# EAGLE design BalloonBoard (EAGLE 6.3)
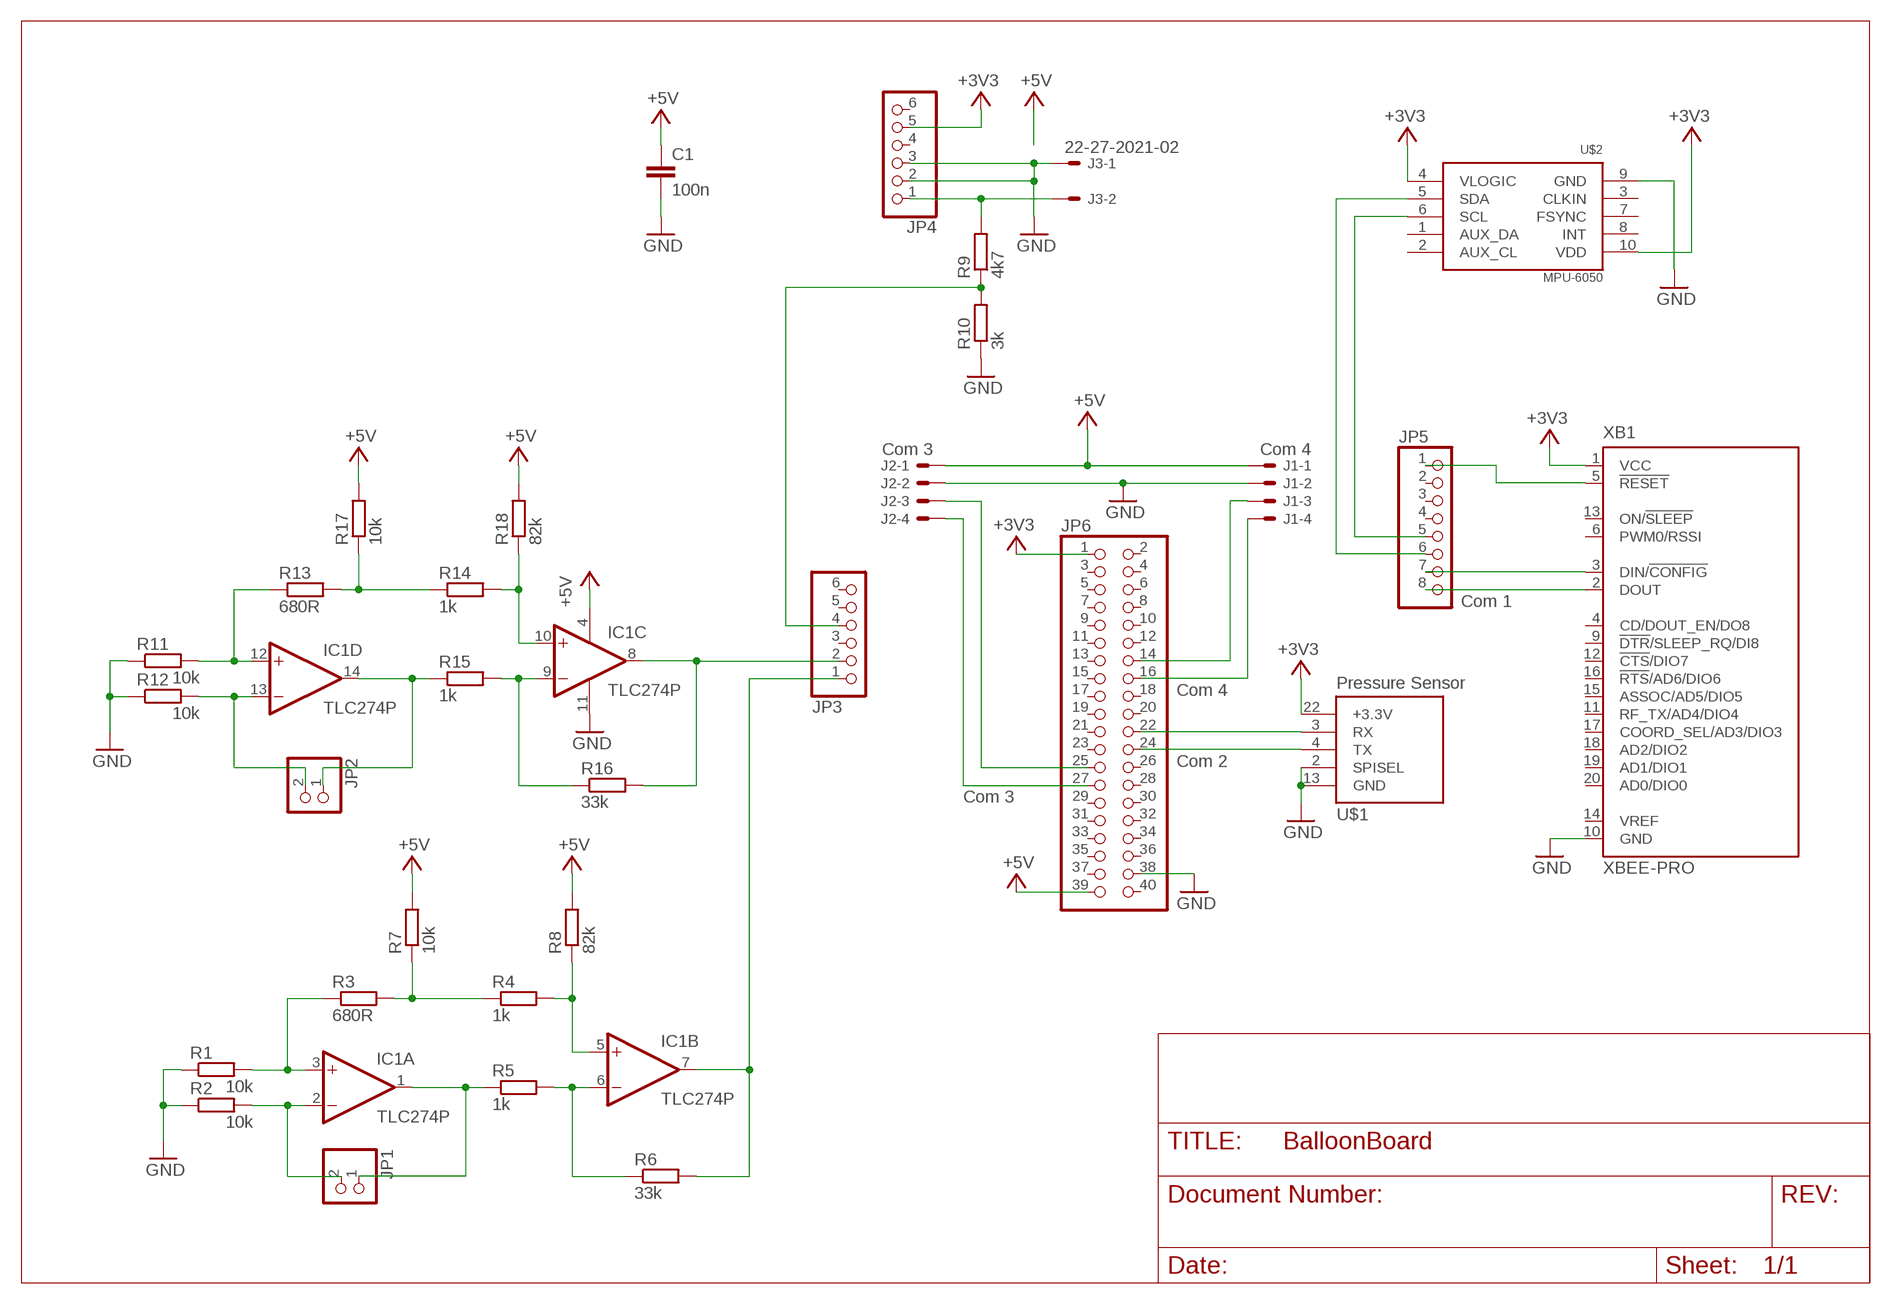
[diagram p0: schematic, sheet 1]

## Parts
C1  100n  C2.5/2  [C2.5-2]
IC1  TLC274P  [DIL14]
J1  Com 4  22-27-2041-04  [6410-04]
J2  Com 3  22-27-2041-04  [6410-04]
J3  22-27-2021-02  [6410-02]
JP1  PINHD-1X2  [1X02]
JP2  PINHD-1X2  [1X02]
JP3  PINHD-1X6  [1X06]
JP4  PINHD-1X6  [1X06]
JP5  PINHD-1X8  [1X08]
JP6  PINHD-2X20  [2X20]
R1  10k  R-EU_0207/10  [0207/10]
R2  10k  R-EU_0207/10  [0207/10]
R3  680R  R-EU_0207/10  [0207/10]
R4  1k  R-EU_0207/10  [0207/10]
R5  1k  R-EU_0207/10  [0207/10]
R6  33k  R-EU_0207/10  [0207/10]
R7  10k  R-EU_0207/10  [0207/10]
R8  82k  R-EU_0207/10  [0207/10]
R9  4k7  R-EU_0207/10  [0207/10]
R10  3k  R-EU_0207/10  [0207/10]
R11  10k  R-EU_0207/10  [0207/10]
R12  10k  R-EU_0207/10  [0207/10]
R13  680R  R-EU_0207/10  [0207/10]
R14  1k  R-EU_0207/10  [0207/10]
R15  1k  R-EU_0207/12  [0207/12]
R16  33k  R-EU_0207/10  [0207/10]
R17  10k  R-EU_0207/10  [0207/10]
R18  82k  R-EU_0207/10  [0207/10]
U$1  PRESSUREMODULE  [DIL24]
U$2  MPU-6050  [MPU-6050_BREAKOUT]
XB1  XBEE-PRO  [XBEE-PRO]

## Nets
+3V3: JP6.1 U$1.22(+3.3V) XB1.1(VCC)
+3V3_B: JP4.5 U$2.4(VLOGIC) U$2.10(VDD) ; supply symbol labelled +3V3
+5V: C1.1 IC1.4(P:V+) J1.1 J2.1 JP6.39 R7.2 R8.2 R17.2 R18.2
GND: C1.2 IC1.11(P:V-) J1.2 J2.2 J3.1 JP4.2 JP4.3 JP6.38 R1.1 R2.1 R10.1 R11.1 R12.1 U$1.2(SPISEL) U$1.13(GND) U$2.9(GND) XB1.10(GND)
N$1: IC1.2(A:-IN) JP1.2 R2.2
N$2: IC1.3(A:+IN) R1.2 R3.1
N$3: R3.2 R4.1 R7.1
N$4: IC1.5(B:+IN) R4.2 R8.1
N$5: IC1.6(B:-IN) R5.2 R6.1
N$6: IC1.1(A:OUT) JP1.1 R5.1
N$7: IC1.13(D:-IN) JP2.2 R12.2
N$8: J3.2 JP4.1 R9.2
N$9: IC1.7(B:OUT) JP3.1 R6.2
N$10: IC1.12(D:+IN) R11.2 R13.1
N$11: R13.2 R14.1 R17.1
N$12: IC1.10(C:+IN) R14.2 R18.1
N$13: IC1.9(C:-IN) R15.2 R16.1
N$14: IC1.14(D:OUT) JP2.1 R15.1
N$15: JP5.1 XB1.5(!RESET)
N$16: IC1.8(C:OUT) JP3.2 R16.2
N$17: JP5.8 XB1.2(DOUT)
N$18: JP5.7 XB1.3(DIN/!CONFIG)
N$19: JP3.4 R9.1 R10.2
N$20: JP5.6 U$2.5(SDA)
N$21: J1.3 JP6.14
N$22: J1.4 JP6.16
N$23: J2.3 JP6.25
N$24: J2.4 JP6.27
N$25: JP5.5 U$2.6(SCL)
N$26: JP6.22 U$1.3(RX)
N$27: JP6.24 U$1.4(TX)
Unconnected: JP3.3 JP3.5 JP3.6 JP4.4 JP4.6 JP5.2 JP5.3 JP5.4 JP6.2 JP6.3 JP6.4 JP6.5 JP6.6 JP6.7 JP6.8 JP6.9 JP6.10 JP6.11 JP6.12 JP6.13 JP6.15 JP6.17 JP6.18 JP6.19 JP6.20 JP6.21 JP6.23 JP6.26 JP6.28 JP6.29 JP6.30 JP6.31 JP6.32 JP6.33 JP6.34 JP6.35 JP6.36 JP6.37 JP6.40 U$2.1(AUX_DA) U$2.2(AUX_CL) U$2.3(CLKIN) U$2.7(FSYNC) U$2.8(INT) XB1.4(CD/DOUT_EN/DO8) XB1.6(PWM0/RSSI) XB1.9(!DTR!/SLEEP_RQ/DI8) XB1.11(RF_TX/AD4/DIO4) XB1.12(!CTS!/DIO7) XB1.13(ON/!SLEEP) XB1.14(VREF) XB1.15(ASSOC/AD5/DIO5) XB1.16(!RTS!/AD6/DIO6) XB1.17(COORD_SEL/AD3/DIO3) XB1.18(AD2/DIO2) XB1.19(AD1/DIO1) XB1.20(AD0/DIO0)

## Notes on the sheet
- Com 1
- Com 4
- Com 2
- Com 3

## Library data of the parts
C1 = capacitor-wima:C: CAPACITOR naming: grid - package width
IC1 = linear:TLC274: OP AMP
J1 J2 = con-molex:22-?-04: CONNECTOR wire to board 2.54 mm (.1 inch) pitch header; OC_FARNELL: unknown; OC_NEWARK: unknown
J3 = con-molex:22-?-02: CONNECTOR wire to board 2.54 mm (.1 inch) pitch header; OC_FARNELL: unknown; OC_NEWARK: unknown
JP1 JP2 = pinhead:PINHD-1X2: PIN HEADER
JP3 JP4 = pinhead:PINHD-1X6: PIN HEADER
JP5 = pinhead:PINHD-1X8: PIN HEADER
JP6 = pinhead:PINHD-2X20: PIN HEADER
R1-R18 = resistor:R-EU_: RESISTOR, European symbol
U$1 = SpaceBallonV3:PRESSUREMODULE
U$2 = SpaceBallonV3:MPU-6050
XB1 = maxstream:XBEE: XBee (TM) /XBee-PRO(TM) OEM RF Modules Source: MaxStream, Inc. xbee_productmanual.pdf; MPN: XBP24-AWI-001; OC_FARNELL: 1337916; OC_NEWARK: 42M2667

## Board
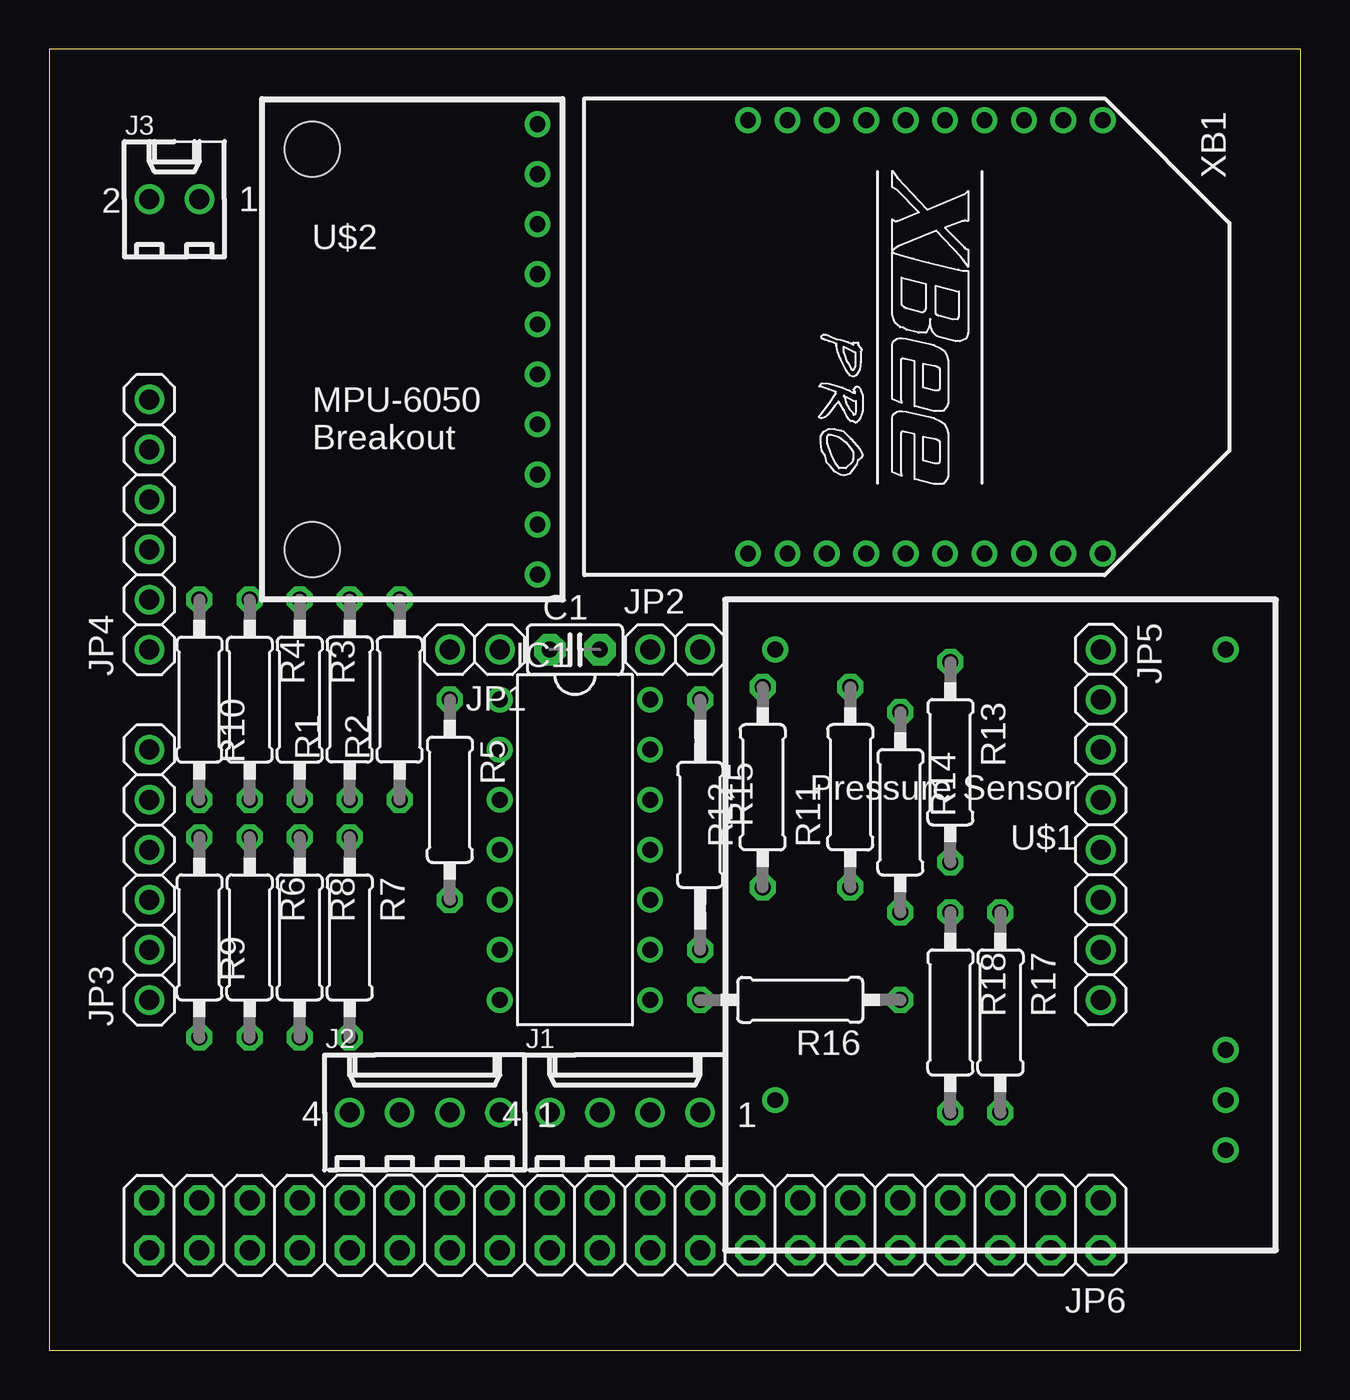
[diagram p1: board, top side]
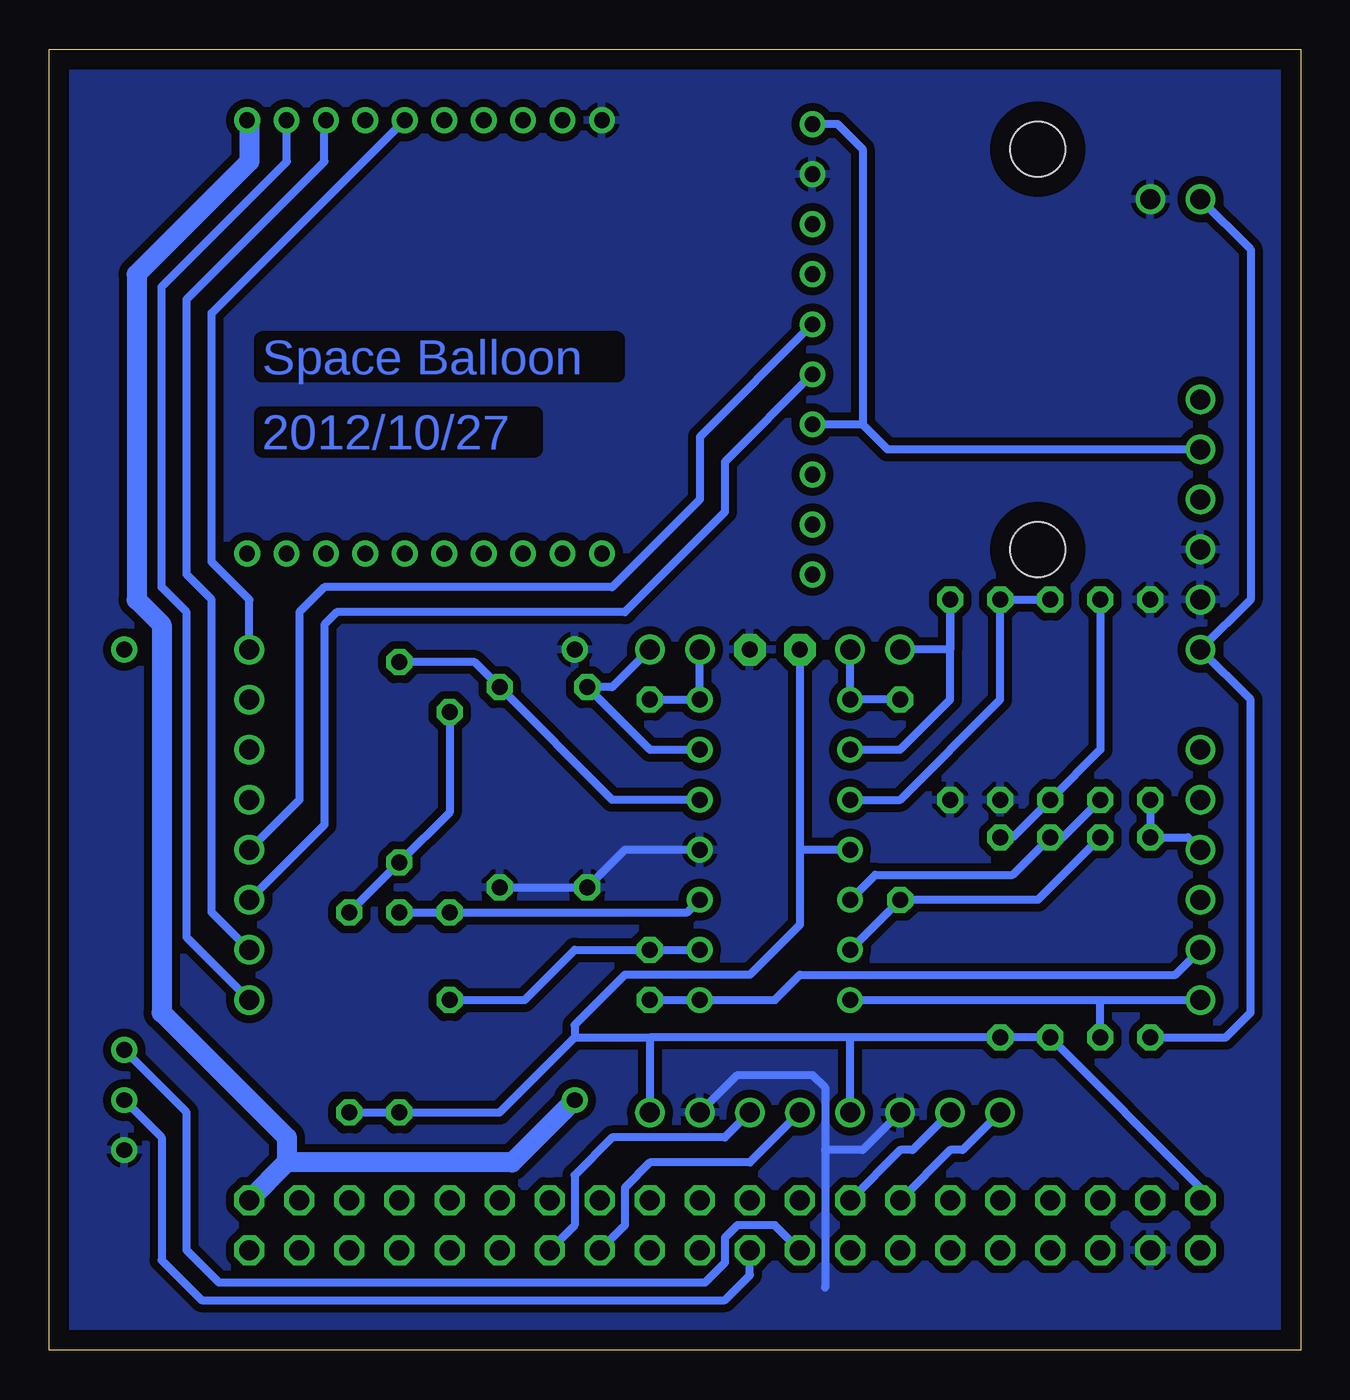
[diagram p2: board, bottom side, seen from below]

Size 63.49 x 66.03 mm. Coordinates in mm from the lower left corner, seen from the top.
Outline: 0,0 63.49,0 63.49,66.03 0,66.03 0,0
Copper layers (1*16): Top 0.035mm / dielectric 1.5mm / Bottom 0.035mm
Design rules "default": minimum track width 10mil, minimum drill 24mil, track to track 8mil, track to pad 8mil, pad to pad 8mil, via to via 8mil, smd to smd 8mil, copper to edge 40mil, drill to drill 8mil, minimum pad ring 10mil, minimum via ring 8mil, stop-mask expansion 4mil, vias tented up to drill 0mil, thermal gap 10mil

### Footprints (pad centres in the part's own frame; a part is rotated, then mirrored left to right if it is on the bottom)
C2.5-2 = drill 0.813 pad 1.6 octagon: 1 -1.27,0; 2 1.27,0
DIL14 = drill 0.813 long: 1 -7.62,-3.81; 2 -5.08,-3.81; 3 -2.54,-3.81; 4 0,-3.81; 5 2.54,-3.81; 6 5.08,-3.81; 7 7.62,-3.81; 8 7.62,3.81; 9 5.08,3.81; 10 2.54,3.81; 11 0,3.81; 12 -2.54,3.81; 13 -5.08,3.81; 14 -7.62,3.81
6410-04 = drill 1.016 long: 1 3.81,0; 2 1.27,0; 3 -1.27,0; 4 -3.81,0
6410-02 = drill 1.016 long: 1 1.27,0; 2 -1.27,0
1X02 = drill 1.016 long: 1 -1.27,0; 2 1.27,0
1X06 = drill 1.016 long: 1 -6.35,0; 2 -3.81,0; 3 -1.27,0; 4 1.27,0; 5 3.81,0; 6 6.35,0
1X08 = drill 1.016 long: 1 -8.89,0; 2 -6.35,0; 3 -3.81,0; 4 -1.27,0; 5 1.27,0; 6 3.81,0; 7 6.35,0; 8 8.89,0
2X20 = drill 1.016 octagon: 1 -24.13,-1.27; 2 -24.13,1.27; 3 -21.59,-1.27; 4 -21.59,1.27; 5 -19.05,-1.27; 6 -19.05,1.27; 7 -16.51,-1.27; 8 -16.51,1.27; 9 -13.97,-1.27; 10 -13.97,1.27; 11 -11.43,-1.27; 12 -11.43,1.27; 13 -8.89,-1.27; 14 -8.89,1.27; 15 -6.35,-1.27; 16 -6.35,1.27; 17 -3.81,-1.27; 18 -3.81,1.27; 19 -1.27,-1.27; 20 -1.27,1.27; 21 1.27,-1.27; 22 1.27,1.27; 23 3.81,-1.27; 24 3.81,1.27; 25 6.35,-1.27; 26 6.35,1.27; 27 8.89,-1.27; 28 8.89,1.27; 29 11.43,-1.27; 30 11.43,1.27; 31 13.97,-1.27; 32 13.97,1.27; 33 16.51,-1.27; 34 16.51,1.27; 35 19.05,-1.27; 36 19.05,1.27; 37 21.59,-1.27; 38 21.59,1.27; 39 24.13,-1.27; 40 24.13,1.27
0207/10 = drill 0.813 octagon: 1 -5.08,0; 2 5.08,0
0207/12 = drill 0.813 octagon: 1 -6.35,0; 2 6.35,0
DIL24 = drill 0.8: 2 -11.43,11.43; 3 -11.43,8.89; 4 -11.43,6.35; 12 -11.43,-13.97; 13 11.43,-13.97; 22 11.43,8.89
MPU-6050_BREAKOUT = drill 0.8: 1 6.35,-11.43; 2 6.35,-8.89; 3 6.35,-6.35; 4 6.35,-3.81; 5 6.35,-1.27; 6 6.35,1.27; 7 6.35,3.81; 8 6.35,6.35; 9 6.35,8.89; 10 6.35,11.43 | hole 2.8: -5.08,10.16; -5.08,-10.16
XBEE-PRO = drill 0.8 pad 1.27: 1 -11,9; 2 -11,7; 3 -11,5; 4 -11,3; 5 -11,1; 6 -11,-1; 7 -11,-3; 8 -11,-5; 9 -11,-7; 10 -11,-9; 11 11,-9; 12 11,-7; 13 11,-5; 14 11,-3; 15 11,-1; 16 11,1; 17 11,3; 18 11,5; 19 11,7; 20 11,9

### Placement (x,y rotation side)
C1  26.67,35.56 0 top
IC1  26.67,25.4 270 top
J1  29.21,12.06 0 top
J2  19.05,12.06 0 top
J3  6.35,58.42 0 top
JP1  21.59,35.56 180 top
JP2  31.75,35.56 0 top
JP3  5.08,24.13 90 top
JP4  5.08,41.91 90 top
JP5  53.34,26.67 270 top
JP6  29.21,6.35 180 top
R1  15.24,33.02 90 top
R2  17.78,33.02 90 top
R3  12.7,33.02 270 top
R4  10.16,33.02 270 top
R5  20.32,27.94 270 top
R6  10.16,20.95 270 top
R7  15.24,20.95 270 top
R8  12.7,20.95 270 top
R9  7.62,20.95 270 top
R10  7.62,33.02 270 top
R11  40.64,28.57 90 top
R12  36.2,28.57 90 top
R13  45.72,29.84 270 top
R14  43.18,27.3 270 top
R15  33.02,26.67 270 top
R16  38.1,17.78 180 top
R17  48.26,17.14 270 top
R18  45.72,17.14 270 top
U$1  48.26,21.59 180 top
U$2  18.41,50.8 0 top
XB1  44.45,51.44 270 top

### Tracks (layer width: path | path; a pad name or v marks a point on that pad's centre or on a via)
+3V3
  Bottom 0.406: XB1.1 53.34,62.44
  Bottom 1.016: U$1.22 40.01,9.53 51.44,9.53 | 51.44,9.53 JP6.1 | 53.34,62.44 53.34,60.33 59.05,54.61 59.05,38.1 57.78,36.83 57.78,17.14 51.44,10.79 51.44,9.53
+3V3_B
  Bottom 0.406: JP4.5 20.95,45.72 22.23,46.99 | 22.23,46.99 22.23,60.96 23.5,62.23 U$2.10 | 22.23,46.99 U$2.4
+5V
  Bottom 0.406: C1.1 25.4,25.4 | IC1.4 25.4,25.4 | 25.4,25.4 25.4,21.59 27.94,19.05 34.29,19.05 36.83,16.51 36.83,15.88 | 22.86,15.88 R7.2 R8.2 5.08,8.26 JP6.39 | 22.86,15.88 33.02,15.88 | J2.1 22.86,15.88 | R17.2 R18.2 40.64,12.06 36.83,15.88 | 36.83,15.88 33.02,15.88 | 33.02,15.88 J1.1
GND
  Bottom 0.406: J1.2 28.57,13.97 24.77,13.97 24.13,13.34 24.13,10.16 | 24.13,10.16 24.13,3.17 | R11.1 R12.1 34.29,25.4 IC1.11 | J2.2 22.23,10.16 24.13,10.16
  pour Bottom (isolate 0.406): 0.64,65.41 0.64,0.64 62.87,0.64 62.87,65.41
N$1
  Bottom 0.406: IC1.2 20.32,30.48 17.78,33.02 R2.2 17.78,35.56 JP1.2
N$2
  Bottom 0.406: IC1.3 20.32,27.94 15.24,33.02 R1.2 R3.1
N$3
  Bottom 0.406: R7.1 14.61,26.04 R3.2 10.16,30.48 R4.1
N$4
  Bottom 0.406: IC1.5 21.59,24.13 14.61,24.13 R8.1 12.06,26.04 R4.2
N$5
  Bottom 0.406: R6.1 13.34,22.86 R5.2 IC1.6
N$6
  Bottom 0.406: JP1.1 IC1.1 R5.1
N$7
  Bottom 0.406: JP2.2 34.92,33.66 R12.2 33.02,30.48 IC1.13
N$8
  Bottom 0.406: R9.2 3.81,15.88 2.54,17.14 2.54,33.02 JP4.1 2.54,38.1 2.54,55.88 J3.2
N$9
  Bottom 0.406: IC1.7 10.16,17.78 | R6.2 10.16,17.78 | 10.16,17.78 JP3.1
N$10
  Bottom 0.406: IC1.12 34.92,27.94 R11.2 41.91,34.92 R13.1
N$11
  Bottom 0.406: R17.1 R13.2 43.18,27.3 R14.1
N$12
  Bottom 0.406: R14.2 R18.1 31.11,22.23 IC1.10
N$13
  Bottom 0.406: R16.1 39.37,17.78 36.83,20.32 R15.2 IC1.9
N$14
  Bottom 0.406: JP2.1 IC1.14 R15.1
N$15
  Bottom 0.406: JP5.1 53.34,38.1 55.24,40.01 55.24,52.64 XB1.5
N$16
  Bottom 0.406: R16.2 IC1.8 26.67,17.78 25.4,19.05 6.35,19.05 JP3.2
N$17
  Bottom 0.406: JP5.8 56.52,20.95 56.52,37.47 57.78,38.73 57.78,53.98 51.44,60.33 XB1.2
N$18
  Bottom 0.406: JP5.7 55.24,22.23 55.24,38.1 56.52,39.37 56.52,53.34 49.53,60.33 49.53,62.23 XB1.3
N$19
  Bottom 0.406: R10.2 R9.1 5.71,26.04 JP3.4
N$20
  Bottom 0.406: U$2.5 29.21,45.09 29.21,42.55 34.29,37.47 48.9,37.47 49.53,36.83 49.53,26.67 JP5.6
N$21
  Bottom 0.406: JP6.14 36.83,6.35 36.83,8.89 34.92,10.79 29.21,10.79 J1.3
N$22
  Bottom 0.406: JP6.16 34.29,6.35 34.29,8.26 33.02,9.53 27.94,9.53 J1.4
N$23
  Bottom 0.406: J2.3 19.68,10.16 20.32,10.16 JP6.25
N$24
  Bottom 0.406: J2.4 17.14,10.16 17.78,10.16 JP6.27
N$25
  Bottom 0.406: U$2.6 30.48,46.35 30.48,43.18 34.92,38.73 49.53,38.73 50.8,37.47 50.8,27.94 JP5.5
N$26
  Bottom 0.406: U$1.3 57.78,10.79 57.78,4.57 55.75,2.54 29.21,2.54 27.94,3.81 JP6.22
N$27
  Bottom 0.406: JP6.24 26.67,6.35 28.57,6.35 29.21,5.71 29.21,4.45 30.23,3.43 54.86,3.43 56.52,5.08 56.52,12.06 U$1.4

### Text on the board
Bottom: Space Balloon | 2012/10/27